# Altium schematic sheet MPU9250.SchDoc
size A4
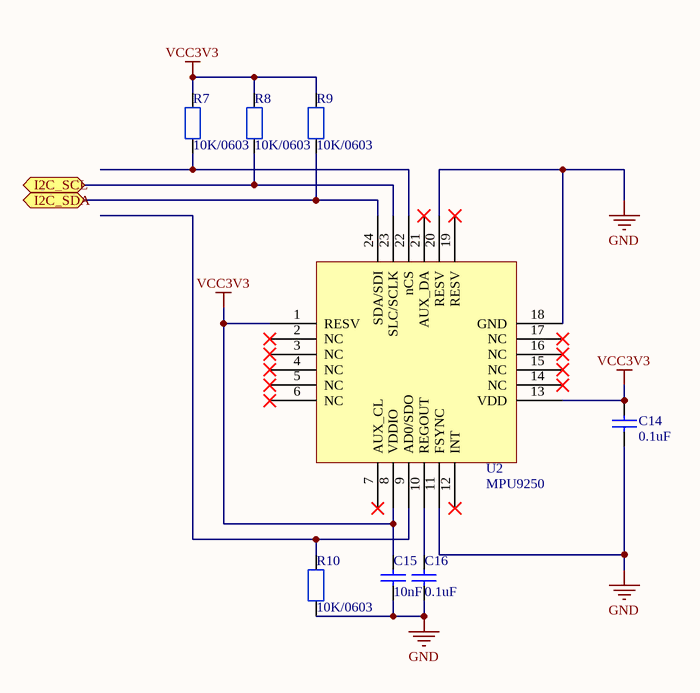
[diagram p0: MPU9250.SchDoc]

## Parts
C14  0.1uF  [C0603]
C15  10nF  [C0603]
C16  0.1uF  [C0603]
R7  10K/0603  [R0603]
R8  10K/0603  [R0603]
R9  10K/0603  [R0603]
R10  10K/0603  [R0603]
U2  MPU9250  [QFN24]

## Ports
I2C_SCL, I2C_SDA

## Nets
GND: C14.1 C15.1 C16.1 R10.1 U2.11(FSYNC) U2.18(GND) U2.20(RESV)
VCC3V3: C14.2 C15.2 R7.2 R8.2 R9.2 U2.1(RESV) U2.8(VDDIO) U2.13(VDD)
I2C_SCL: R8.1 U2.23(SLC/SCLK) ; port I2C_SCL
I2C_SDA: R9.1 U2.24(SDA/SDI) ; port I2C_SDA
NetC16_2: C16.2 U2.10(REGOUT)
NetR7_1: R7.1 U2.22(nCS)
NetR10_2: R10.2 U2.9(AD0/SDO)

Not connected (* = marked no-connect by the designer): U2 2(NC)* 3(NC)* 4(NC)* 5(NC)* 6(NC)* 7(AUX_CL)* 12(INT)* 14(NC)* 15(NC)* 16(NC)* 17(NC)* 19(RESV)* 21(AUX_DA)*

## Library data of the parts
C14-C16 = CAP: 无极性贴片电容
R7-R10 = RES